# Altium schematic sheet uC_input.SchDoc
size A; SheetNumber: 10; SheetTotal: 12; SPICEModelCacheXWDQNBJN: <root> / <DocumentId>XWDQNBJN</DocumentId> / </root>
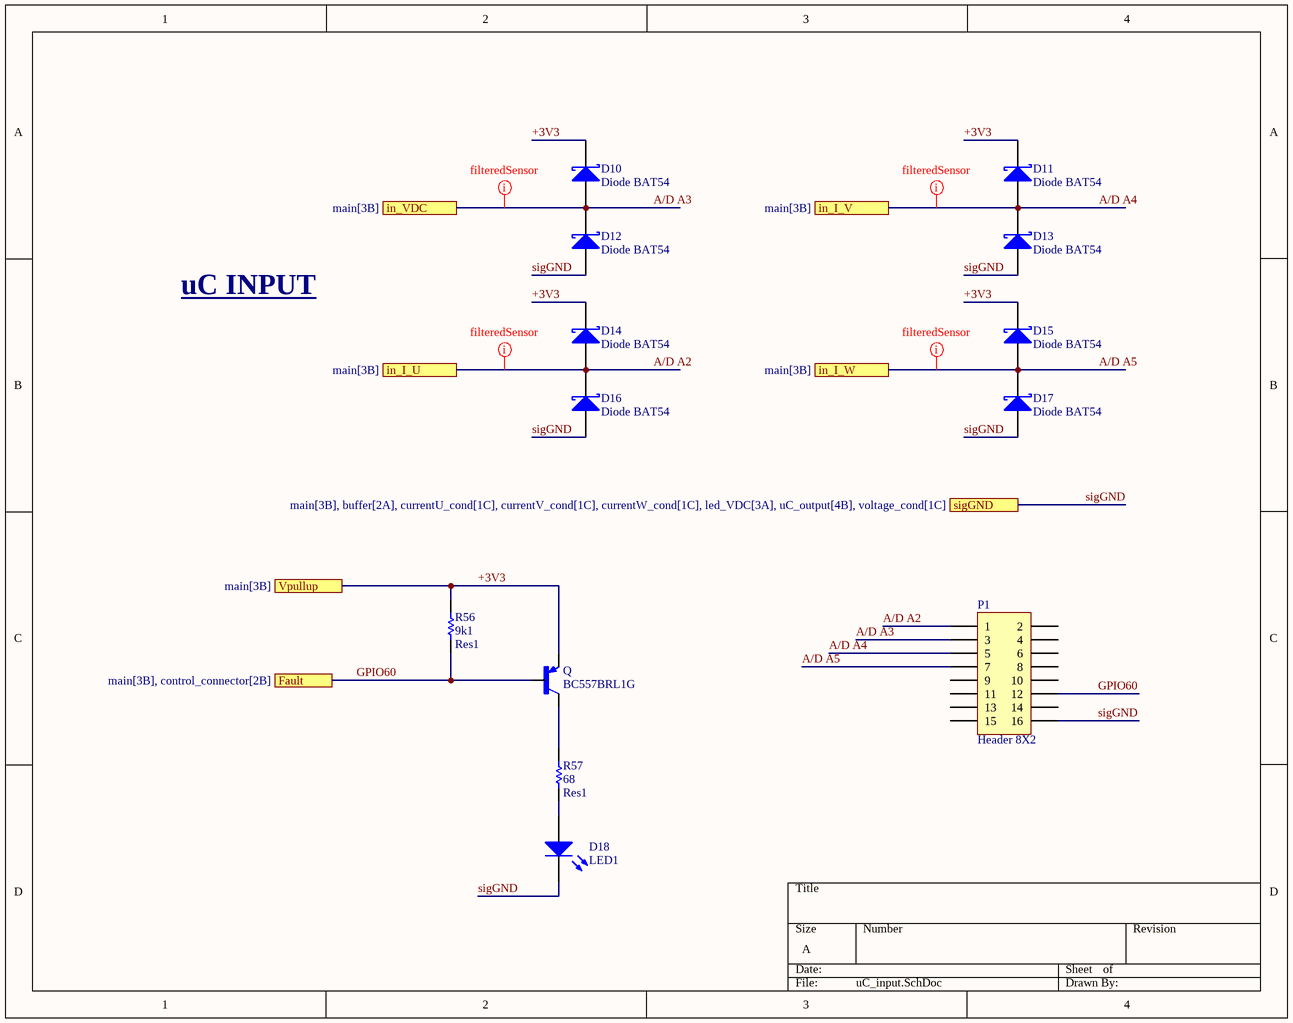
[diagram p0: uC_input.SchDoc]

## Parts
D10  Diode BAT54  [DO-41_mod]
D11  Diode BAT54  [DO-41_mod]
D12  Diode BAT54  [DO-41_mod]
D13  Diode BAT54  [DO-41_mod]
D14  Diode BAT54  [DO-41_mod]
D15  Diode BAT54  [DO-41_mod]
D16  Diode BAT54  [DO-41_mod]
D17  Diode BAT54  [DO-41_mod]
D18  LED1  [PIN2_mod]
P1  Header 8X2  [HDR2X8_mod]
Q  BC557BRL1G  [TO92260P520H933-3_mod]
R56  Res1  value 9k1  [AXIAL-0.3_mod]
R57  Res1  value 68  [AXIAL-0.3_mod]

## Ports
Fault (see main[3B], control_connector[2B]), in_I_U (see main[3B]), in_I_V (see main[3B]), in_I_W (see main[3B]), in_VDC (see main[3B]), sigGND (see main[3B], buffer[2A], currentU_cond[1C], currentV_cond[1C], currentW_cond[1C], led_VDC[3A], uC_output[4B], voltage_cond[1C]), Vpullup (see main[3B])

## Nets
+3V3: D10.2(K) D11.2(K) D14.2(K) D15.2(K) Q.3(E) R56.1 ; port Vpullup
A/D A2: D14.1(A) D16.2(K) P1.1 ; port in_I_U
A/D A3: D10.1(A) D12.2(K) P1.3 ; port in_VDC
A/D A4: D11.1(A) D13.2(K) P1.5 ; port in_I_V
A/D A5: D15.1(A) D17.2(K) P1.7 ; port in_I_W
GPIO60: P1.12 Q.2(B) R56.2 ; port Fault
sigGND: D12.1(A) D13.1(A) D16.1(A) D17.1(A) D18.2(K) P1.16 ; port sigGND
NetD18_1: D18.1(A) R57.2
NetQ_1: Q.1(C) R57.1

Not connected (* = marked no-connect by the designer): P1 2 4 6 8 9 10 11 13 14 15

## Layout directives
net class filteredSensor: A/D A2, A/D A3, A/D A4, A/D A5

## Notes on the sheet
- uC INPUT

## Library data of the parts
D10-D17 = Diode 11DQ03: Schottky Rectifier; Published: 8-Jun-2000; LatestRevisionDate: 17-Jul-2002; LatestRevisionNote: Re-released for DXP Platform.; DatasheetVersion: Dec-1997; PackageReference: DO-204AL; Publisher: Altium Limited; PackageDescription: Diode, Axial; Body 5.2 x 2.7 mm (LxDia. max), Lead Dia. 0.86 mm (max); Code_JEDEC: DO-204-AL; ComponentLink1Description: Manufacturer Link; ComponentLink1URL: http://www.irf.com/; ComponentLink2Description: Datasheet; ComponentLink2URL: http://www.irf.com/product-info/datasheets/data/11dq03.pdf
D18 = LED1: Typical RED GaAs LED; Published: 8-Jun-2000; LatestRevisionDate: 08-Jul-2005; LatestRevisionNote: Mech Layer 1 removed.; PackageReference: LED-1; Publisher: Altium Limited; PackageDescription: LED; 2 Leads
P1 = Header 8X2: Header, 8-Pin, Dual row; LatestRevisionDate: 17-Jul-2002; LatestRevisionNote: Re-released for DXP Platform.; Publisher: Altium Limited
Q = BC557BRL1G: Bipolar (BJT) Transistor PNP 45V 100mA 320MHz 625mW Through Hole TO-92-3; MF: ON Semiconductor; Availability: Good; Value: *; SnapEDA_Link: https://www.snapeda.com/parts/BC557BRL1G/ON%20Semiconductor/view-part/3219064/?ref=snap; Arrow_Electronics-Purchase-URL: https://snapeda.com/shop?store=Arrow+Electronics&id=3219064; Price: None; Package: TO-92 ON Semiconductor; MP: BC557BRL1G; DigiKey-Purchase-URL: https://snapeda.com/shop?store=DigiKey&id=3219064; BuyPart: https://www.snapeda.com/parts/BC557BRL1G/ON%20Semiconductor/view-part/3219064/?ref=eda
R56 R57 = Res1: Resistor; Published: 8-Jun-2000; LatestRevisionDate: 17-Jul-2002; LatestRevisionNote: Re-released for DXP Platform.; PackageReference: AXIAL-0.3; Publisher: Altium Limited; PackageDescription: Axial Device, Thru-Hole; 2 Leads; 0.3 in Pin Spacing